# EAGLE schematic rc-light-controller-tlc5940-lpc812 (EAGLE 6.5.0)
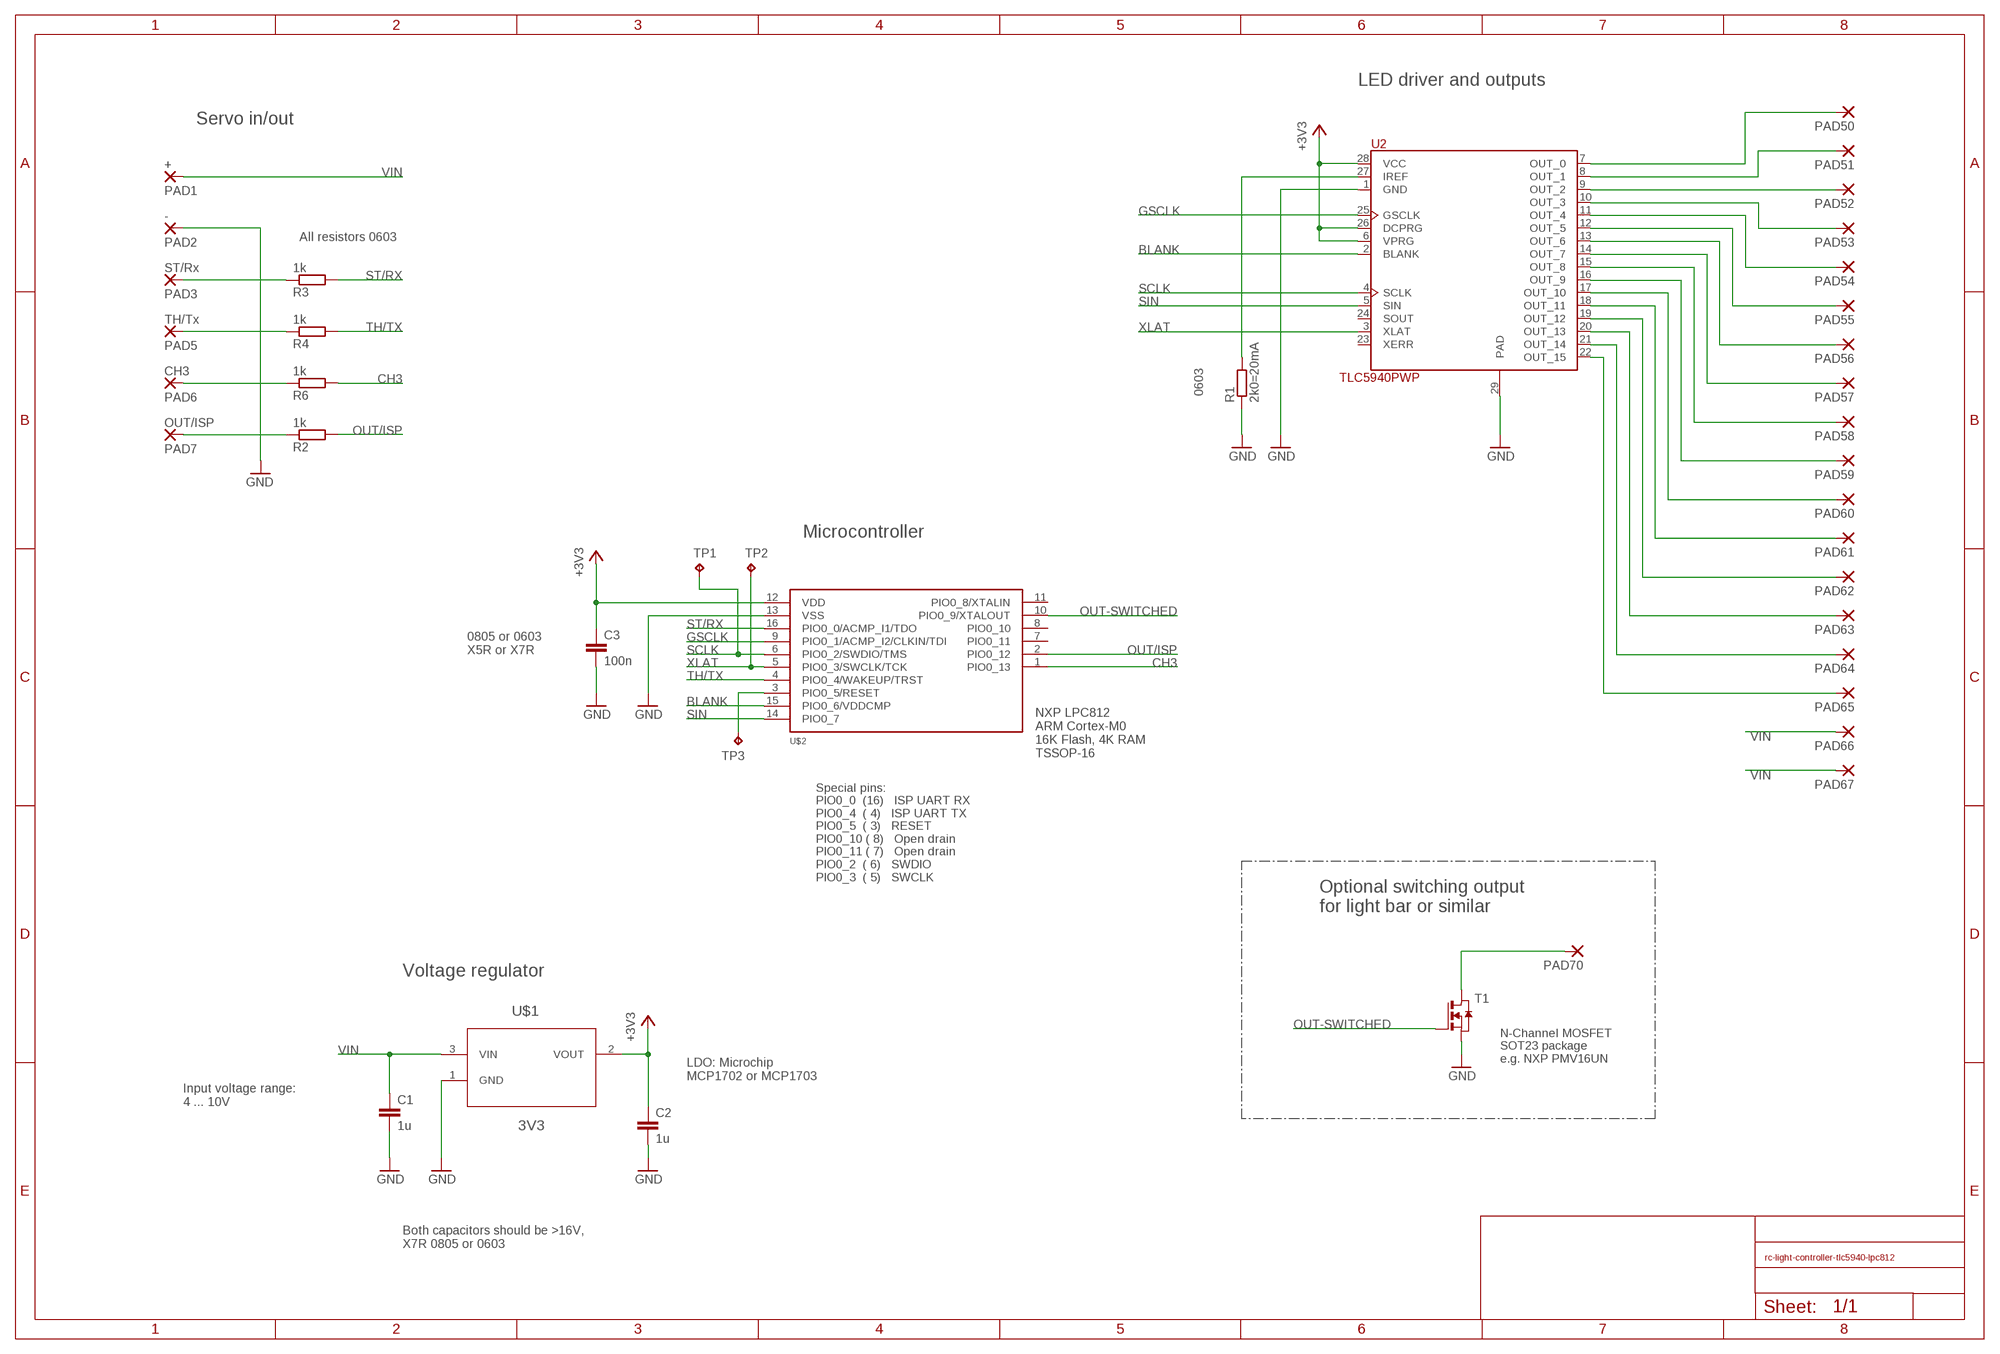
[diagram p0: schematic, sheet 1]

## Parts
C1  1u  C-EUC0805  [C0805]
C2  1u  C-EUC0805  [C0805]
C3  100n  C-EUC0805  [C0805]
PAD1  +  SDM80X120  [SMD80X120]
PAD2  -  SDM80X120  [SMD80X120]
PAD3  ST/Rx  SDM80X120  [SMD80X120]
PAD5  TH/Tx  SDM80X120  [SMD80X120]
PAD6  CH3  SDM80X120  [SMD80X120]
PAD7  OUT/ISP  SDM80X120  [SMD80X120]
PAD50  SMD50X100  [SMD50X100]
PAD51  SMD50X100  [SMD50X100]
PAD52  SMD50X100  [SMD50X100]
PAD53  SMD50X100  [SMD50X100]
PAD54  SMD50X100  [SMD50X100]
PAD55  SMD50X100  [SMD50X100]
PAD56  SMD50X100  [SMD50X100]
PAD57  SMD50X100  [SMD50X100]
PAD58  SMD50X100  [SMD50X100]
PAD59  SMD50X100  [SMD50X100]
PAD60  SMD50X100  [SMD50X100]
PAD61  SMD50X100  [SMD50X100]
PAD62  SMD50X100  [SMD50X100]
PAD63  SMD50X100  [SMD50X100]
PAD64  SMD50X100  [SMD50X100]
PAD65  SMD50X100  [SMD50X100]
PAD66  SMD50X100  [SMD50X100]
PAD67  SMD50X100  [SMD50X100]
PAD70  SMD50X100  [SMD50X100]
R1  2k0=20mA  R-EU_R0805  [R0805]
R2  1k  R-EU_R0603  [R0603]
R3  1k  R-EU_R0603  [R0603]
R4  1k  R-EU_R0603  [R0603]
R6  1k  R-EU_R0603  [R0603]
T1  NMOSSOT23  [SOT-23]
TP1  SWDIO  TPTP10R  [TP10R]
TP2  SWCLK  TPTP10R  [TP10R]
TP3  RESET  TPTP10R  [TP10R]
U2  TLC5940PWP  [SOP65P640X120-29N]
U$1  3V3  MCP1703T-3302E/CB  [SOT95P300X145-3N]
U$2  LPC812  LPC812M101JDH16  [TSSOP16]

## Nets
+3V3: C2.1 C3.1 U2.6(VPRG) U2.26(DCPRG) U2.28(VCC) U$1.2(VOUT) U$2.12(VDD)
BLANK: U2.2(BLANK) U$2.15(PIO0_6/VDDCMP)
CH3: R6.2 U$2.1(PIO0_13)
GND: C1.2 C2.2 C3.2 PAD2.1(P) R1.1 T1.2(S) U2.1(GND) U2.29(PAD) U$1.1(GND) U$2.13(VSS)
GSCLK: U2.25(GSCLK) U$2.9(PIO0_1/ACMP_I2/CLKIN/TDI)
IREF: R1.2 U2.27(IREF)
N$1: PAD6.1(P) R6.1
N$3: PAD70.1(P) T1.1(D)
N$4: TP3.TP U$2.3(PIO0_5/RESET)
N$5: PAD7.1(P) R2.1
N$17: PAD3.1(P) R3.1
N$18: PAD5.1(P) R4.1
OUT0: PAD50.1(P) U2.7(OUT_0)
OUT1: PAD51.1(P) U2.8(OUT_1)
OUT2: PAD52.1(P) U2.9(OUT_2)
OUT3: PAD53.1(P) U2.10(OUT_3)
OUT4: PAD54.1(P) U2.11(OUT_4)
OUT5: PAD55.1(P) U2.12(OUT_5)
OUT6: PAD56.1(P) U2.13(OUT_6)
OUT7: PAD57.1(P) U2.14(OUT_7)
OUT8: PAD58.1(P) U2.15(OUT_8)
OUT9: PAD59.1(P) U2.16(OUT_9)
OUT10: PAD60.1(P) U2.17(OUT_10)
OUT11: PAD61.1(P) U2.18(OUT_11)
OUT12: PAD62.1(P) U2.19(OUT_12)
OUT13: PAD63.1(P) U2.20(OUT_13)
OUT14: PAD64.1(P) U2.21(OUT_14)
OUT15: PAD65.1(P) U2.22(OUT_15)
OUT-SWITCHED: T1.3(G) U$2.10(PIO0_9/XTALOUT)
OUT/ISP: R2.2 U$2.2(PIO0_12)
SCLK: TP1.TP U2.4(SCLK) U$2.6(PIO0_2/SWDIO/TMS)
SIN: U2.5(SIN) U$2.14(PIO0_7)
ST/RX: R3.2 U$2.16(PIO0_0/ACMP_I1/TDO)
TH/TX: R4.2 U$2.4(PIO0_4/WAKEUP/TRST)
VIN: C1.1 PAD1.1(P) PAD66.1(P) PAD67.1(P) U$1.3(VIN)
XLAT: TP2.TP U2.3(XLAT) U$2.5(PIO0_3/SWCLK/TCK)
Unconnected: U2.23(XERR) U2.24(SOUT) U$2.7(PIO0_11) U$2.8(PIO0_10) U$2.11(PIO0_8/XTALIN)

## Notes on the sheet
- LED driver and outputs
- Servo in/out
- All resistors 0603
- 0603
- Microcontroller
- 0805 or 0603
  X5R or X7R
- NXP LPC812
  ARM Cortex-M0
  16K Flash, 4K RAM
  TSSOP-16
- Special pins:
  PIO0_0  (16)   ISP UART RX
  PIO0_4  ( 4)   ISP UART TX
  PIO0_5  ( 3)   RESET
  PIO0_10 ( 8)   Open drain
  PIO0_11 ( 7)   Open drain
  PIO0_2  ( 6)   SWDIO
  PIO0_3  ( 5)   SWCLK
- Optional switching output
  for light bar or similar
- Voltage regulator
- N-Channel MOSFET
  SOT23 package
  e.g. NXP PMV16UN
- LDO: Microchip 
  MCP1702 or MCP1703
- Input voltage range:
  4 ... 10V
- Both capacitors should be >16V, 
  X7R 0805 or 0603

## Library data of the parts
C1-C3 = rcl:C-EU: CAPACITOR, European symbol
PAD1-PAD3 PAD5-PAD7 = wirepad:SDM80X120
PAD50-PAD67 PAD70 = wirepad:SMD50X100: SMD PAD
R1-R4 R6 = rcl:R-EU_: RESISTOR, European symbol
T1 = zetex:NMOSSOT23: MOS FET; OC_FARNELL: unknown; OC_NEWARK: unknown
TP1-TP3 = testpad:TP: Test pad
U2 = tlc5940:TLC5940: 16 CHANNEL LED DRIVER WITH DOT CORRECTION AND GRAYSCALE PWM CONTROL; MPN: TLC5940PWP; PACKAGE: HTSSOP-28; SUPPLIER: Texas Instruments
U$1 = MCP1703:MCP1703T-3302E/CB: Low Quiescent Current LDO Regulator; MPN: MCP1703T-3302E/CB; OC_FARNELL: 1439518; OC_NEWARK: 40M0637; PACKAGE: SOT-3; SUPPLIER: Microchip
U$2 = LPC810:LPC812M101JDH16